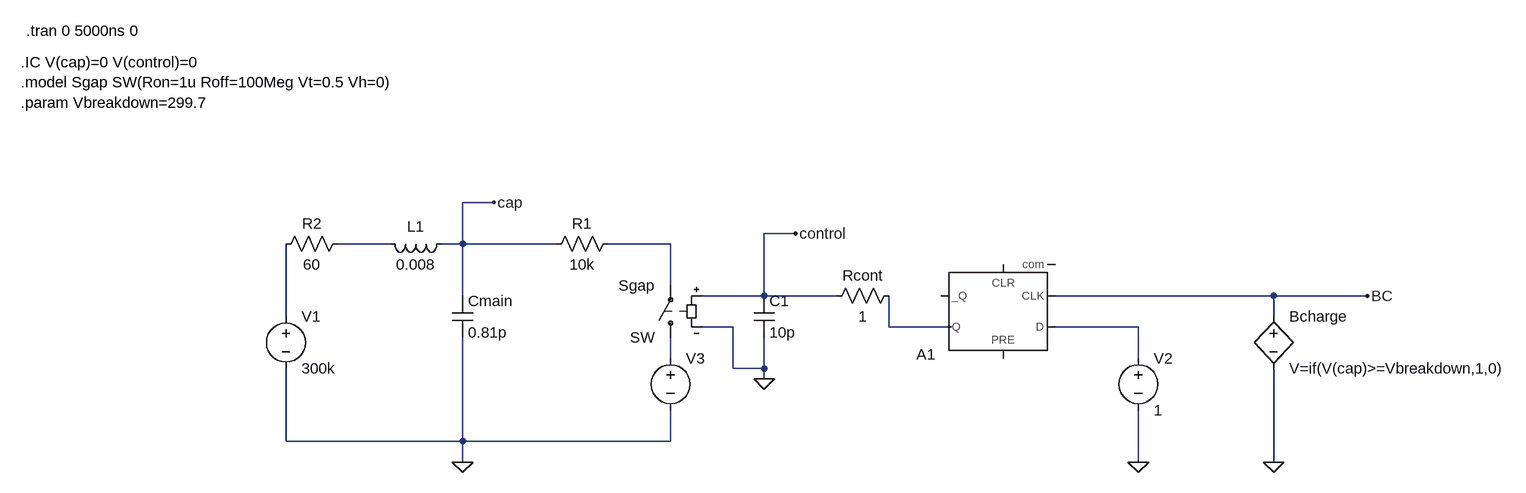
[diagram p0: schematic sg_marxgenerator.asc]
sg_marxgenerator.asc, the LTspice schematic file:
Version 4
SHEET 1 1600 680
WIRE 0 224 -48 224
WIRE 464 272 416 272
WIRE -160 288 -240 288
WIRE -48 288 -48 224
WIRE -48 288 -80 288
WIRE 96 288 -48 288
WIRE 272 288 176 288
WIRE 272 352 272 288
WIRE -48 368 -48 288
WIRE 416 368 416 272
WIRE 416 368 320 368
WIRE 528 368 416 368
WIRE 1200 368 864 368
WIRE 1344 368 1200 368
WIRE -320 400 -320 288
WIRE 1200 400 1200 368
WIRE 368 416 320 416
WIRE 608 416 608 368
WIRE 704 416 608 416
WIRE 992 416 864 416
WIRE 272 464 272 432
WIRE 992 464 992 416
WIRE 368 480 368 416
WIRE 416 480 416 432
WIRE 416 480 368 480
WIRE 416 496 416 480
WIRE -320 592 -320 480
WIRE -48 592 -48 432
WIRE -48 592 -320 592
WIRE 272 592 272 544
WIRE 272 592 -48 592
WIRE -48 624 -48 592
WIRE 992 624 992 544
WIRE 1200 624 1200 480
FLAG 416 496 0
FLAG -48 624 0
FLAG 992 624 0
FLAG 1200 624 0
FLAG 464 272 control
FLAG 0 224 cap
FLAG 1344 368 BC
SYMBOL voltage -320 384 R0
WINDOW 123 0 0 Left 0
WINDOW 39 0 0 Left 0
SYMATTR InstName V1
SYMATTR Value 300k
SYMBOL voltage 992 448 R0
WINDOW 123 0 0 Left 0
WINDOW 39 0 0 Left 0
SYMATTR InstName V2
SYMATTR Value 1
SYMBOL voltage 272 448 R0
WINDOW 123 0 0 Left 0
WINDOW 39 24 44 Left 2
SYMATTR InstName V3
SYMATTR Value ""
SYMBOL res 624 352 R90
WINDOW 0 0 56 VBottom 2
WINDOW 3 32 56 VTop 2
SYMATTR InstName Rcont
SYMATTR Value 1
SYMBOL cap -64 368 R0
SYMATTR InstName Cmain
SYMATTR Value 0.81p
SYMBOL cap 400 368 R0
SYMATTR InstName C1
SYMATTR Value 10p
SYMBOL bv 1200 384 R0
SYMATTR InstName Bcharge
SYMATTR Value V=if(V(cap)>=Vbreakdown,1,0)
SYMBOL Digital\\dflop 784 464 R180
SYMATTR InstName A1
SYMBOL sw 272 448 R180
SYMATTR InstName SW
SYMATTR Value Sgap
SYMBOL ind -64 272 R90
WINDOW 0 5 56 VBottom 2
WINDOW 3 32 56 VTop 2
SYMATTR InstName L1
SYMATTR Value 0.008
SYMBOL res 192 272 R90
WINDOW 0 0 56 VBottom 2
WINDOW 3 32 56 VTop 2
SYMATTR InstName R1
SYMATTR Value 10k
SYMBOL res -224 272 R90
WINDOW 0 0 56 VBottom 2
WINDOW 3 32 56 VTop 2
SYMATTR InstName R2
SYMATTR Value 60
TEXT -728 8 Left 2 !.IC V(cap)=0 V(control)=0\n.model Sgap SW(Ron=1u Roff=100Meg Vt=0.5 Vh=0)\n.param Vbreakdown=299.7
TEXT -720 -40 Left 2 !.tran 0 5000ns 0

The netlist it stands for:
* sg_marxgenerator.asc
V1 N003 0 300k
V2 N005 0 1
V3 N006 0
Rcont N004 control 1
Cmain cap 0 0.81p
C1 control 0 10p
Bcharge BC 0 V=if(V(cap)>=Vbreakdown,1,0)
A1 N005 0 BC 0 0 0 N004 0 DFLOP
SW N006 N002 control 0 Sgap
L1 cap N001 0.008
R1 N002 cap 10k
R2 N001 N003 60
.IC V(cap)=0 V(control)=0
.model Sgap SW(Ron=1u Roff=100Meg Vt=0.5 Vh=0)
.param Vbreakdown=299.7
.tran 0 5000ns 0
.backanno
.end